# EAGLE design Arduino Full Breakout (EAGLE 6.5.0)
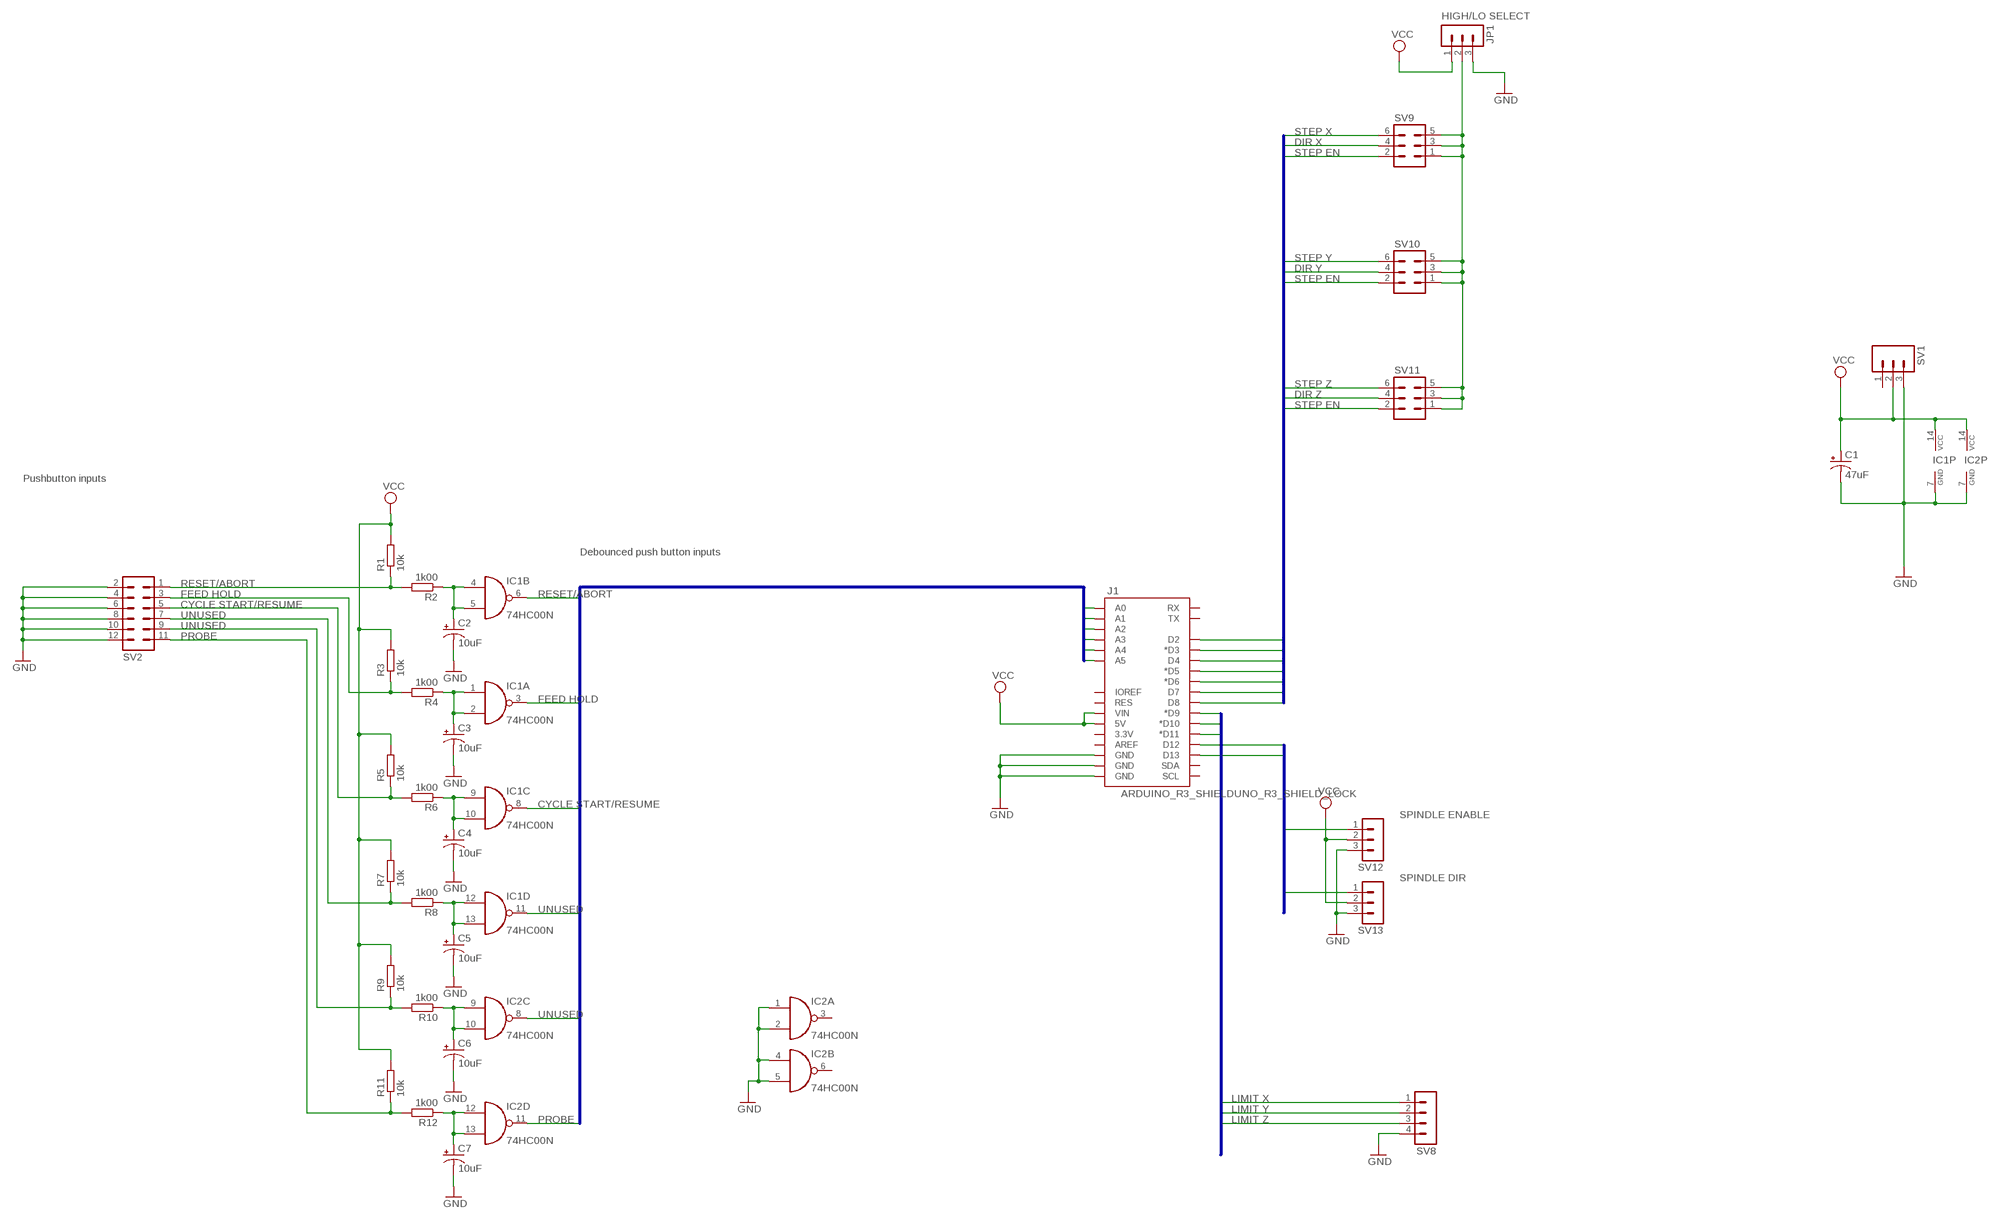
[diagram p0: schematic, sheet 1]

## Parts
C1  47uF  CAP_POLPTH2  [CPOL-RADIAL-10UF-25V]
C2  10uF  CAP_POLPTH2  [CPOL-RADIAL-10UF-25V]
C3  10uF  CAP_POLPTH2  [CPOL-RADIAL-10UF-25V]
C4  10uF  CAP_POLPTH2  [CPOL-RADIAL-10UF-25V]
C5  10uF  CAP_POLPTH2  [CPOL-RADIAL-10UF-25V]
C6  10uF  CAP_POLPTH2  [CPOL-RADIAL-10UF-25V]
C7  10uF  CAP_POLPTH2  [CPOL-RADIAL-10UF-25V]
IC1  74HC00N  [DIL14]
IC2  74HC00N  [DIL14]
J1  ARDUINO_R3_SHIELDUNO_R3_SHIELD_LOCK  [UNO_R3_SHIELD_LOCK]
JP1  MA03-1  [MA03-1]
R1  10k  R-EU_0207/5V  [0207/5V]
R2  1k00  R-EU_0207/7  [0207/7]
R3  10k  R-EU_0207/7  [0207/7]
R4  1k00  R-EU_0207/7  [0207/7]
R5  10k  R-EU_0207/10  [0207/10]
R6  1k00  R-EU_0207/7  [0207/7]
R7  10k  R-EU_0207/10  [0207/10]
R8  1k00  R-EU_0207/7  [0207/7]
R9  10k  R-EU_0207/7  [0207/7]
R10  1k00  R-EU_0207/7  [0207/7]
R11  10k  R-EU_0207/5V  [0207/5V]
R12  1k00  R-EU_0207/7  [0207/7]
SV1  M03-SCREW-5MM  [SCREWTERMINAL-5MM-3]
SV2  MA06-2  [MA06-2]
SV8  MA04-1  [MA04-1]
SV9  MA03-2  [MA03-2]
SV10  MA03-2  [MA03-2]
SV11  MA03-2  [MA03-2]
SV12  MA03-1  [MA03-1]
SV13  MA03-1  [MA03-1]

## Nets
BUTTONS0: IC1.6(B:O) J1.A0
BUTTONS1: IC1.3(A:O) J1.A1
BUTTONS2: IC1.8(C:O) J1.A2
BUTTONS3: IC1.11(D:O) J1.A3
BUTTONS4: IC2.8(C:O) J1.A4
BUTTONS5: IC2.11(D:O) J1.A5
GND: C1.2(-) C2.2(-) C3.2(-) C4.2(-) C5.2(-) C6.2(-) C7.2(-) IC1.7(P:GND) IC2.1(A:I0) IC2.2(A:I1) IC2.4(B:I0) IC2.5(B:I1) IC2.7(P:GND) J1.GND@0(GND) J1.GND@1(GND) J1.GND@2(GND) JP1.3 SV1.3 SV2.2 SV2.4 SV2.6 SV2.8 SV2.10 SV2.12 SV8.4 SV12.3 SV13.3
LIMITS0: J1.D9(*D9) SV8.1
LIMITS1: J1.D10(*D10) SV8.2
LIMITS2: J1.D11(*D11) SV8.3
N$1: JP1.2 SV9.1 SV9.3 SV9.5 SV10.1 SV10.3 SV10.5 SV11.1 SV11.3 SV11.5
N$3: C2.1(+) IC1.4(B:I0) IC1.5(B:I1) R2.1
N$4: R1.1 R2.2 SV2.1
N$5: C3.1(+) IC1.1(A:I0) IC1.2(A:I1) R4.1
N$6: R3.1 R4.2 SV2.3
N$7: C4.1(+) IC1.9(C:I0) IC1.10(C:I1) R6.1
N$8: R5.1 R6.2 SV2.5
N$10: C5.1(+) IC1.12(D:I0) IC1.13(D:I1) R8.1
N$11: R7.1 R8.2 SV2.7
N$12: C6.1(+) IC2.9(C:I0) IC2.10(C:I1) R10.1
N$13: R9.1 R10.2 SV2.9
N$16: C7.1(+) IC2.12(D:I0) IC2.13(D:I1) R12.1
N$17: R11.1 R12.2 SV2.11
SPINDLE0: J1.D12 SV12.1
SPINDLE1: J1.D13 SV13.1
STEP0: J1.D2 SV9.6
STEP1: J1.D3(*D3) SV10.6
STEP2: J1.D4 SV11.6
STEP3: J1.D5(*D5) SV9.4
STEP4: J1.D6(*D6) SV10.4
STEP5: J1.D7 SV11.4
STEP6: J1.D8 SV9.2 SV10.2 SV11.2
VCC: C1.1(+) IC1.14(P:VCC) IC2.14(P:VCC) J1.VIN JP1.1 R1.2 R3.2 R5.2 R7.2 R9.2 R11.2 SV1.2 SV12.2 SV13.2
Unconnected: IC2.3(A:O) IC2.6(B:O) J1.3.3V J1.5V J1.AREF J1.IOREF J1.RES J1.RX J1.SCL J1.SDA J1.TX SV1.1

## Buses
BUTTONS[0..5]
LIMITS[0..2]
SPINDLE[0..1]
STEP[0..6]

## Notes on the sheet
- HIGH/LO SELECT
- STEP X
- DIR X
- STEP EN
- STEP Y
- DIR Y
- STEP EN
- STEP Z
- DIR Z
- STEP EN
- Pushbutton inputs
- Debounced push button inputs
- RESET/ABORT
- FEED HOLD | RESET/ABORT
- CYCLE START/RESUME
- UNUSED
- UNUSED
- PROBE
- FEED HOLD
- CYCLE START/RESUME
- SPINDLE ENABLE
- SPINDLE DIR
- UNUSED
- UNUSED
- LIMIT X
- LIMIT Y
- PROBE | LIMIT Z

## Library data of the parts
C1-C7 = SparkFun-Passives:CAP_POL: Capacitor Polarized These are standard SMD and PTH capacitors. Normally 10uF, 47uF, and 100uF in electrolytic and tantalum varieties. Always verify the external diameter of the through hole cap, it varies with capacity, voltage, and manufacturer. The EIA devices should be standard.
IC1 IC2 = 74xx-eu:74*00: Quad 2-input NAND gate
J1 = SparkFun-Boards:ARDUINO_R3_SHIELD: Shield form compatible with the Arduino Uno R3.
JP1 SV12 SV13 = con-lstb:MA03-1: PIN HEADER; OC_FARNELL: unknown; OC_NEWARK: unknown
R1-R12 = rcl:R-EU_: RESISTOR, European symbol
SV1 = SparkFun-Connectors:M03: Header 3 Standard 3-pin 0.1" header. Use with straight break away headers (SKU : PRT-00116), right angle break away headers (PRT-00553), swiss pins (PRT-00743), machine pins (PRT-00117), and female headers (PRT-00115). Molex polarized connector foot print use with SKU : PRT-08232 with associated crimp pins and housings.; STOREFRONT_ID: PRT-08433
SV2 = con-lstb:MA06-2: PIN HEADER; OC_FARNELL: unknown; OC_NEWARK: unknown
SV8 = con-lstb:MA04-1: PIN HEADER; OC_FARNELL: unknown; OC_NEWARK: unknown
SV9-SV11 = con-lstb:MA03-2: PIN HEADER; OC_FARNELL: unknown; OC_NEWARK: unknown

## Board
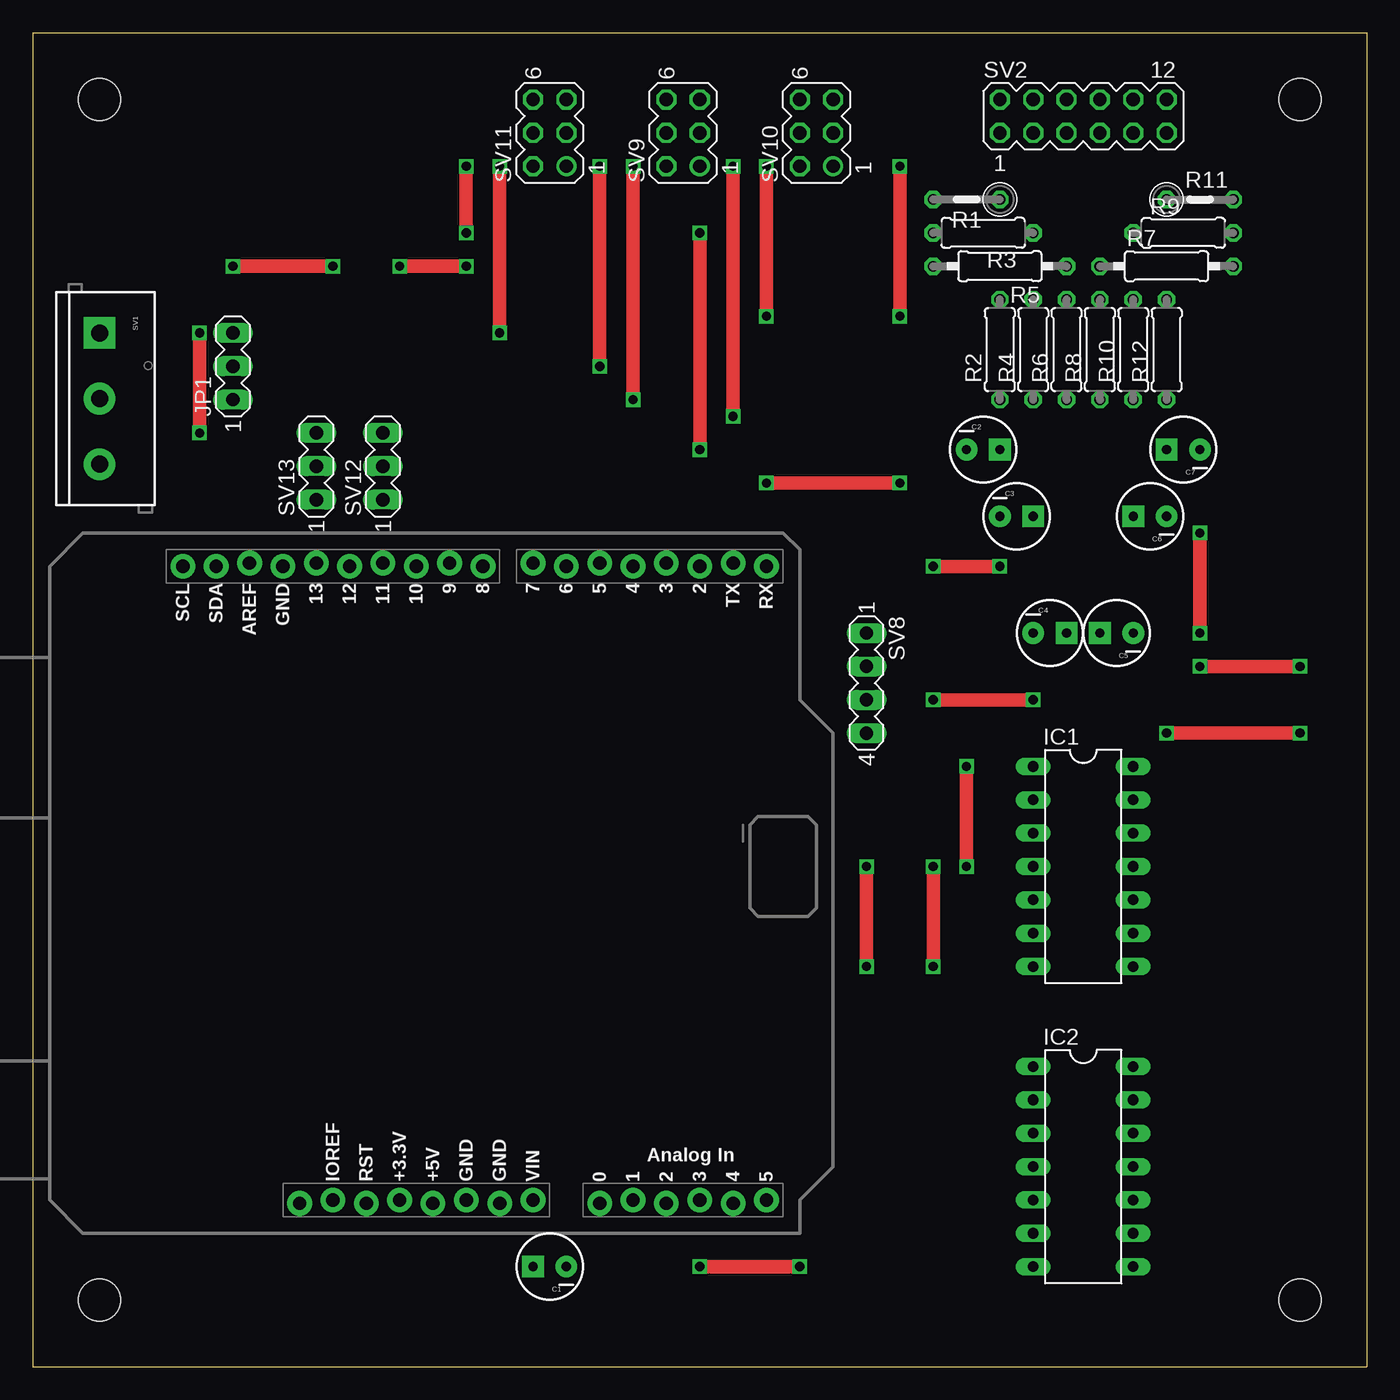
[diagram p1: board, top side]
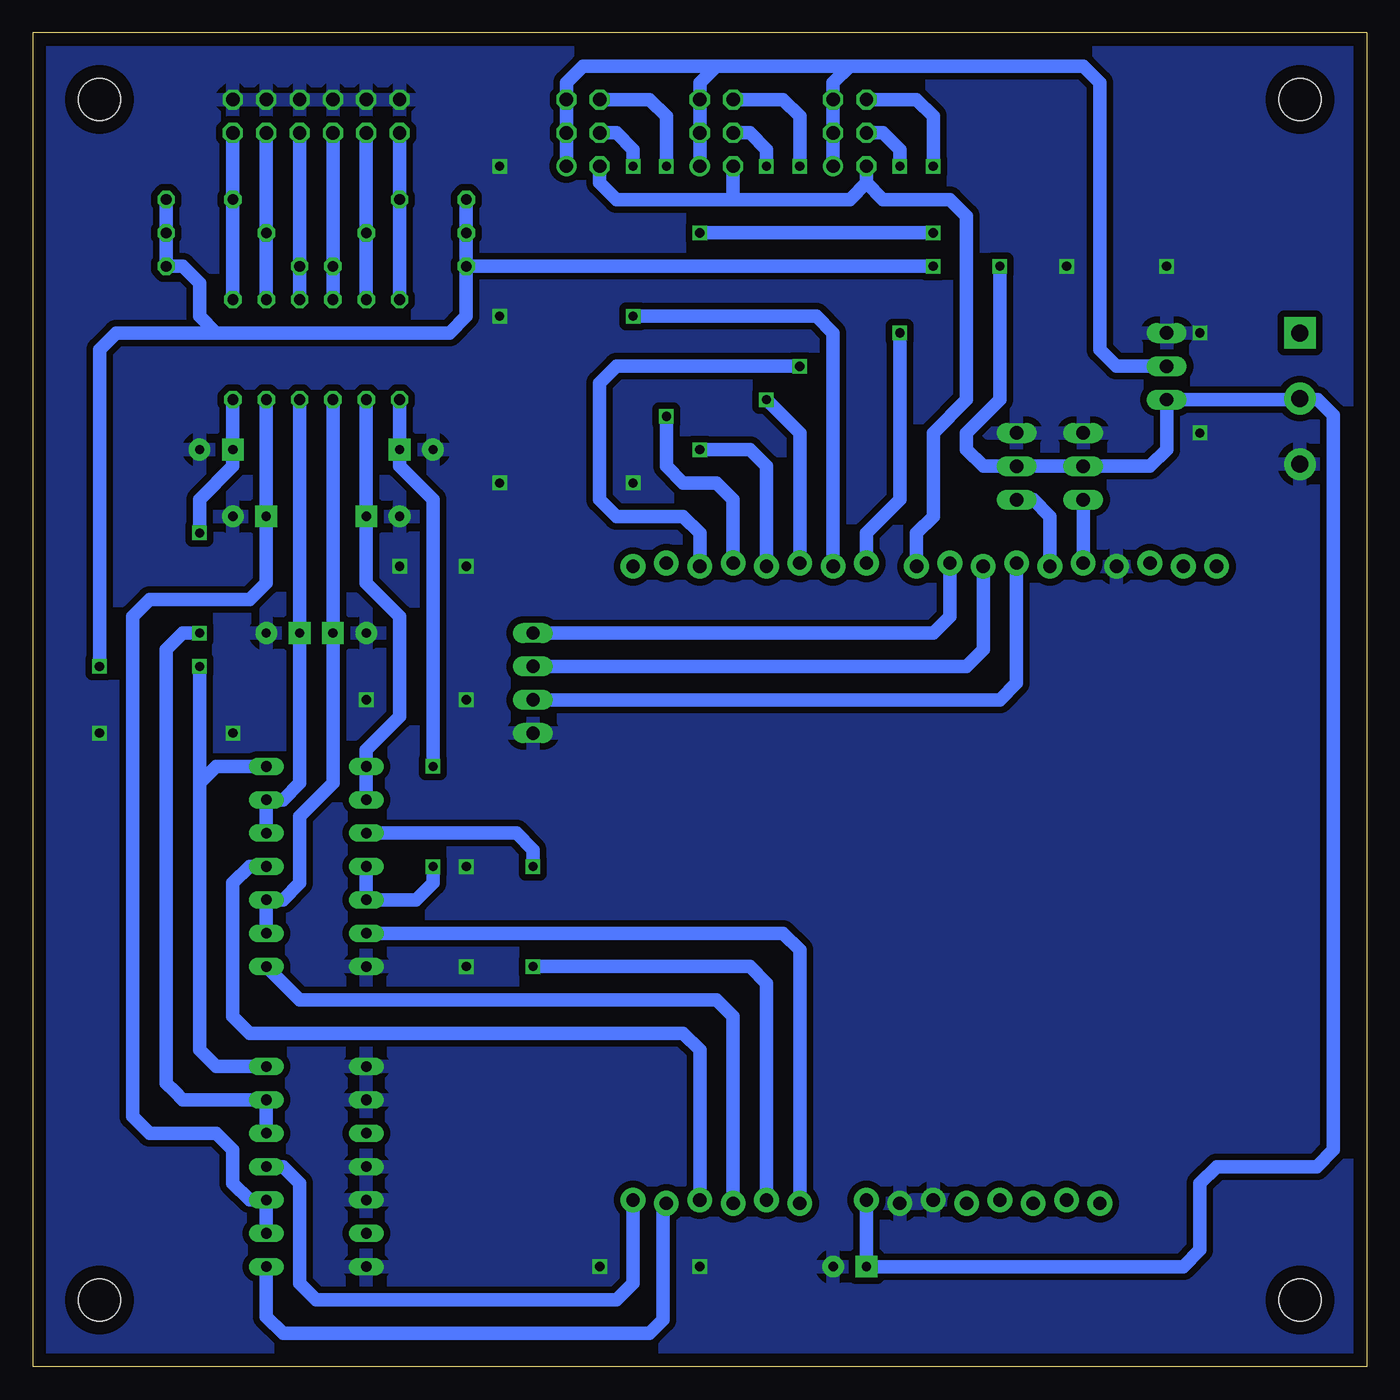
[diagram p2: board, bottom side, seen from below]

Size 101.6 x 101.6 mm. Coordinates in mm from the lower left corner, seen from the top.
Outline: 0,101.6 0,0 101.6,0 101.6,101.6 0,101.6
Copper layers (1*16): Top 0.035mm / dielectric 1.5mm / Bottom 0.035mm
Design rules "BasicHandEtching": minimum track width 40mil, minimum drill 24mil, track to track 20mil, track to pad 20mil, pad to pad 20mil, via to via 20mil, smd to smd 20mil, copper to edge 40mil, drill to drill 8mil, minimum pad ring 10mil, minimum via ring 8mil, stop-mask expansion 4mil, vias tented up to drill 0mil, thermal gap 20mil
Holes 3.2 mm at 5.08,5.08 96.52,5.08 5.08,96.52 96.52,96.52

### Footprints (pad centres in the part's own frame; a part is rotated, then mirrored left to right if it is on the bottom)
CPOL-RADIAL-10UF-25V = drill 0.7 pad 1.651 square: 1 1.27,0 | drill 0.7 pad 1.651: 2 -1.27,0
DIL14 = drill 0.813 long: 1 -7.62,-3.81; 2 -5.08,-3.81; 3 -2.54,-3.81; 4 0,-3.81; 5 2.54,-3.81; 6 5.08,-3.81; 7 7.62,-3.81; 8 7.62,3.81; 9 5.08,3.81; 10 2.54,3.81; 11 0,3.81; 12 -2.54,3.81; 13 -5.08,3.81; 14 -7.62,3.81
UNO_R3_SHIELD_LOCK = drill 1.016 pad 1.88: 3.3V 50.8,26.67; 5V 51.054,29.21; A0 51.054,41.91; A1 50.8,44.45; A2 51.054,46.99; A3 50.8,49.53; A4 51.054,52.07; A5 50.8,54.61; AREF 2.286,15.24; D2 2.54,49.53; D3 2.286,46.99; D4 2.54,44.45; D5 2.286,41.91; D6 2.54,39.37; D7 2.286,36.83; D8 2.54,33.02; D9 2.286,30.48; D10 2.54,27.94; D11 2.286,25.4; D12 2.54,22.86; D13 2.286,20.32; GND@0 50.8,31.75; GND@1 51.054,34.29; GND@2 2.54,17.78; IOREF 50.8,21.59; NC 51.054,19.05; RES 51.054,24.13; RX 2.54,54.61; SCL 2.54,10.16; SDA 2.54,12.7; TX 2.286,52.07; VIN 50.8,36.83
MA03-1 = drill 1.016 long: 1 -2.54,0; 2 0,0; 3 2.54,0
0207/5V = drill 0.813 octagon: 1 -2.54,0; 2 2.54,0
0207/7 = drill 0.813 octagon: 1 -3.81,0; 2 3.81,0
0207/10 = drill 0.813 octagon: 1 -5.08,0; 2 5.08,0
SCREWTERMINAL-5MM-3 = drill 1.3 pad 2.413 square: 1 0,0 | drill 1.3 pad 2.413: 2 5,0; 3 10,0
MA06-2 = drill 1.016 octagon: 1 -6.35,-1.27; 2 -6.35,1.27; 3 -3.81,-1.27; 4 -3.81,1.27; 5 -1.27,-1.27; 6 -1.27,1.27; 7 1.27,-1.27; 8 1.27,1.27; 9 3.81,-1.27; 10 3.81,1.27; 11 6.35,-1.27; 12 6.35,1.27
MA04-1 = drill 1.016 long: 1 -3.81,0; 2 -1.27,0; 3 1.27,0; 4 3.81,0
MA03-2 = drill 1.016: 1 -2.54,-1.27 | drill 1.016 octagon: 2 -2.54,1.27; 3 0,-1.27; 4 0,1.27; 5 2.54,-1.27; 6 2.54,1.27

### Placement (x,y rotation side)
C1  39.37,7.62 180 top
C2  72.39,69.85 0 top
C3  74.93,64.77 0 top
C4  77.47,55.88 0 top
C5  82.55,55.88 180 top
C6  85.09,64.77 180 top
C7  87.63,69.85 180 top
IC1  80.01,38.1 270 top
IC2  80.01,15.24 270 top
J1  1.27,63.5 270 top
JP1  15.24,76.2 90 top
R1  71.12,88.9 180 top
R2  73.66,77.47 90 top
R3  72.39,86.36 180 top
R4  76.2,77.47 90 top
R5  73.66,83.82 180 top
R6  78.74,77.47 90 top
R7  86.36,83.82 0 top
R8  81.28,77.47 90 top
R9  87.63,86.36 0 top
R10  83.82,77.47 90 top
R11  88.9,88.9 0 top
R12  86.36,77.47 90 top
SV1  5.08,78.74 270 top
SV2  80.01,95.25 0 top
SV8  63.5,52.07 270 top
SV9  49.53,93.98 90 top
SV10  59.69,93.98 90 top
SV11  39.37,93.98 90 top
SV12  26.67,68.58 90 top
SV13  21.59,68.58 90 top

### Tracks (layer width: path | path; a pad name or v marks a point on that pad's centre or on a via)
BUTTONS0
  Bottom 1.016: J1.A0 43.18,31.75 44.45,33.02 IC1.6
BUTTONS1  (via drill 0.7)
  Top 1.016: v63.5,30.48 v63.5,38.1
  Bottom 1.016: J1.A1 45.72,29.21 46.99,30.48 v63.5,30.48 | v63.5,38.1 63.5,39.37 64.77,40.64 IC1.3
BUTTONS2
  Bottom 1.016: J1.A2 48.26,26.67 49.53,27.94 81.28,27.94 IC1.8
BUTTONS3
  Bottom 1.016: J1.A3 50.8,24.13 52.07,25.4 85.09,25.4 86.36,26.67 86.36,36.83 85.09,38.1 IC1.11
BUTTONS4
  Bottom 1.016: J1.A4 53.59,12.45 53.59,3.56 54.61,2.54 82.55,2.54 83.82,3.81 IC2.8
BUTTONS5
  Bottom 1.016: J1.A5 55.88,6.35 57.15,5.08 80.01,5.08 81.28,6.35 81.28,13.97 82.55,15.24 IC2.11
GND  (via drill 0.7)
  Top 1.016: v68.58,38.1 v68.58,30.48 | v50.8,7.62 v58.42,7.62 | v68.58,60.96 v73.66,60.96 | v55.88,67.31 v66.04,67.31 | v15.24,83.82 v22.86,83.82 | v12.7,78.74 v12.7,71.12 | v66.04,91.44 v66.04,80.01 | v76.2,50.8 v68.58,50.8 | v96.52,48.26 v86.36,48.26
  pour Bottom: 0,101.6 101.6,101.6 101.6,0 0,0
LIMITS0
  Bottom 1.016: J1.D9 31.75,57.15 33.02,55.88 SV8.1
LIMITS1
  Bottom 1.016: J1.D10 29.21,54.61 30.48,53.34 SV8.2
LIMITS2
  Bottom 1.016: J1.D11 26.67,52.07 27.94,50.8 SV8.3
N$1
  Bottom 1.016: JP1.2 19.05,76.2 20.32,77.47 20.32,97.79 21.59,99.06 39.37,99.06 | SV11.1 SV11.3 SV11.5 40.64,97.79 39.37,99.06 | 39.37,99.06 49.53,99.06 | 49.53,99.06 59.69,99.06 60.96,97.79 SV10.5 SV10.3 SV10.1 | SV9.1 SV9.3 SV9.5 50.8,97.79 49.53,99.06
N$3  (via drill 0.7)
  Top 1.016: v71.12,45.72 v71.12,38.1
  Bottom 1.016: R2.1 C2.1 73.66,68.58 71.12,66.04 v71.12,45.72 | IC1.4 IC1.5 72.39,35.56 71.12,36.83 v71.12,38.1
N$4
  Bottom 1.016: SV2.1 R1.1 R2.2
N$5
  Bottom 1.016: R4.1 C3.1 76.2,59.69 73.66,57.15 73.66,49.53 76.2,46.99 IC1.1 IC1.2
N$6
  Bottom 1.016: SV2.3 R3.1 R4.2
N$7
  Bottom 1.016: R6.1 C4.1 78.74,44.45 81.28,41.91 81.28,36.83 82.55,35.56 IC1.10 IC1.9
N$8
  Bottom 1.016: SV2.5 R5.1 R6.2
N$10
  Bottom 1.016: R8.1 C5.1 81.28,44.45 82.55,43.18 IC1.13 IC1.12
N$11
  Bottom 1.016: SV2.7 R7.1 R8.2
N$12
  Bottom 1.016: R10.1 C6.1 83.82,59.69 85.09,58.42 92.71,58.42 93.98,57.15 93.98,19.05 92.71,17.78 87.63,17.78 86.36,16.51 86.36,13.97 85.09,12.7 IC2.10 IC2.9
N$13
  Bottom 1.016: SV2.9 R9.1 R10.2
N$16  (via drill 0.7)
  Top 1.016: v88.9,55.88 v88.9,63.5
  Bottom 1.016: R12.1 C7.1 86.36,68.58 88.9,66.04 v88.9,63.5 | IC2.12 IC2.13 90.17,20.32 90.81,20.95 91.44,21.59 91.44,54.61 90.17,55.88 v88.9,55.88
N$17
  Bottom 1.016: SV2.11 R11.1 R12.2
SPINDLE0
  Bottom 1.016: J1.D12 24.13,64.77 25.4,66.04 SV12.1
SPINDLE1
  Bottom 1.016: SV13.1 J1.D13
STEP0  (via drill 0.7)
  Top 1.016: v43.18,91.44 v43.18,76.2
  Bottom 1.016: SV9.6 44.45,96.52 43.18,95.25 v43.18,91.44 | J1.D2 50.8,63.5 52.07,64.77 57.15,64.77 58.42,66.04 58.42,74.93 57.15,76.2 v43.18,76.2
STEP1  (via drill 0.7)
  Top 1.016: v53.34,72.39 v53.34,91.44
  Bottom 1.016: SV10.6 54.61,96.52 53.34,95.25 v53.34,91.44 | J1.D3 48.26,66.04 49.53,67.31 52.07,67.31 53.34,68.58 v53.34,72.39
STEP2  (via drill 0.7)
  Top 1.016: v33.02,91.44 v33.02,86.36 | v50.8,86.36 v50.8,69.85
  Bottom 1.016: SV11.6 34.29,96.52 33.02,95.25 v33.02,91.44 | v33.02,86.36 v50.8,86.36 | J1.D4 45.72,68.58 46.99,69.85 v50.8,69.85
STEP3  (via drill 0.7)
  Top 1.016: v45.72,91.44 v45.72,73.66
  Bottom 1.016: SV9.4 46.99,93.98 45.72,92.71 v45.72,91.44 | J1.D5 43.18,71.12 v45.72,73.66
STEP4  (via drill 0.7)
  Top 1.016: v55.88,91.44 v55.88,80.01
  Bottom 1.016: SV10.4 57.15,93.98 55.88,92.71 v55.88,91.44 | v55.88,80.01 41.91,80.01 40.64,78.74 J1.D6
STEP5  (via drill 0.7)
  Top 1.016: v35.56,91.44 v35.56,78.74
  Bottom 1.016: SV11.4 36.83,93.98 35.56,92.71 v35.56,91.44 | v35.56,78.74 35.56,66.04 38.1,63.5 J1.D7
STEP6
  Bottom 1.016: SV11.2 38.1,90.17 | 48.26,88.9 39.37,88.9 38.1,90.17 | SV10.2 58.42,90.17 57.15,88.9 48.26,88.9 | SV9.2 48.26,88.9 | 38.1,90.17 36.83,88.9 31.75,88.9 30.48,87.63 30.48,73.66 33.02,71.12 33.02,64.77 34.29,63.5 J1.D8
VCC  (via drill 0.7)
  Top 1.016: v27.94,83.82 v33.02,83.82 | v96.52,53.34 v88.9,53.34
  Bottom 1.016: 5.08,73.66 JP1.1 15.24,69.85 16.51,68.58 SV13.2 SV12.2 29.21,68.58 30.48,69.85 30.48,71.12 27.94,73.66 v27.94,83.82 | 5.08,73.66 3.73,73.66 2.54,72.47 2.54,16.51 3.81,15.24 11.43,15.24 12.7,13.97 12.7,8.89 13.97,7.62 C1.1 J1.VIN | SV1.2 5.08,73.66 | R5.2 R3.2 R1.2 R5.2 | R11.2 R9.2 R7.2 90.17,83.82 88.9,82.55 88.9,80.01 87.63,78.74 | IC2.14 87.63,22.86 88.9,24.13 v88.9,53.34 88.9,44.45 87.63,45.72 IC1.14 | v33.02,83.82 R5.2 | R5.2 68.58,80.01 69.85,78.74 87.63,78.74 | 87.63,78.74 95.25,78.74 96.52,77.47 v96.52,53.34